# Altium schematic sheet GEM_AFE128_Supply.SchDoc: Supply
size 420 x 297 mm; CheckedBy: K.Belewicz; DrawnBy: G.Kasprowicz; SheetNumber: 5; SheetTotal: 5; ModifiedBy: -; CheckedDate: 12.06.2022; DivGrp: WUT ISE; Designer: G.Kasprowicz
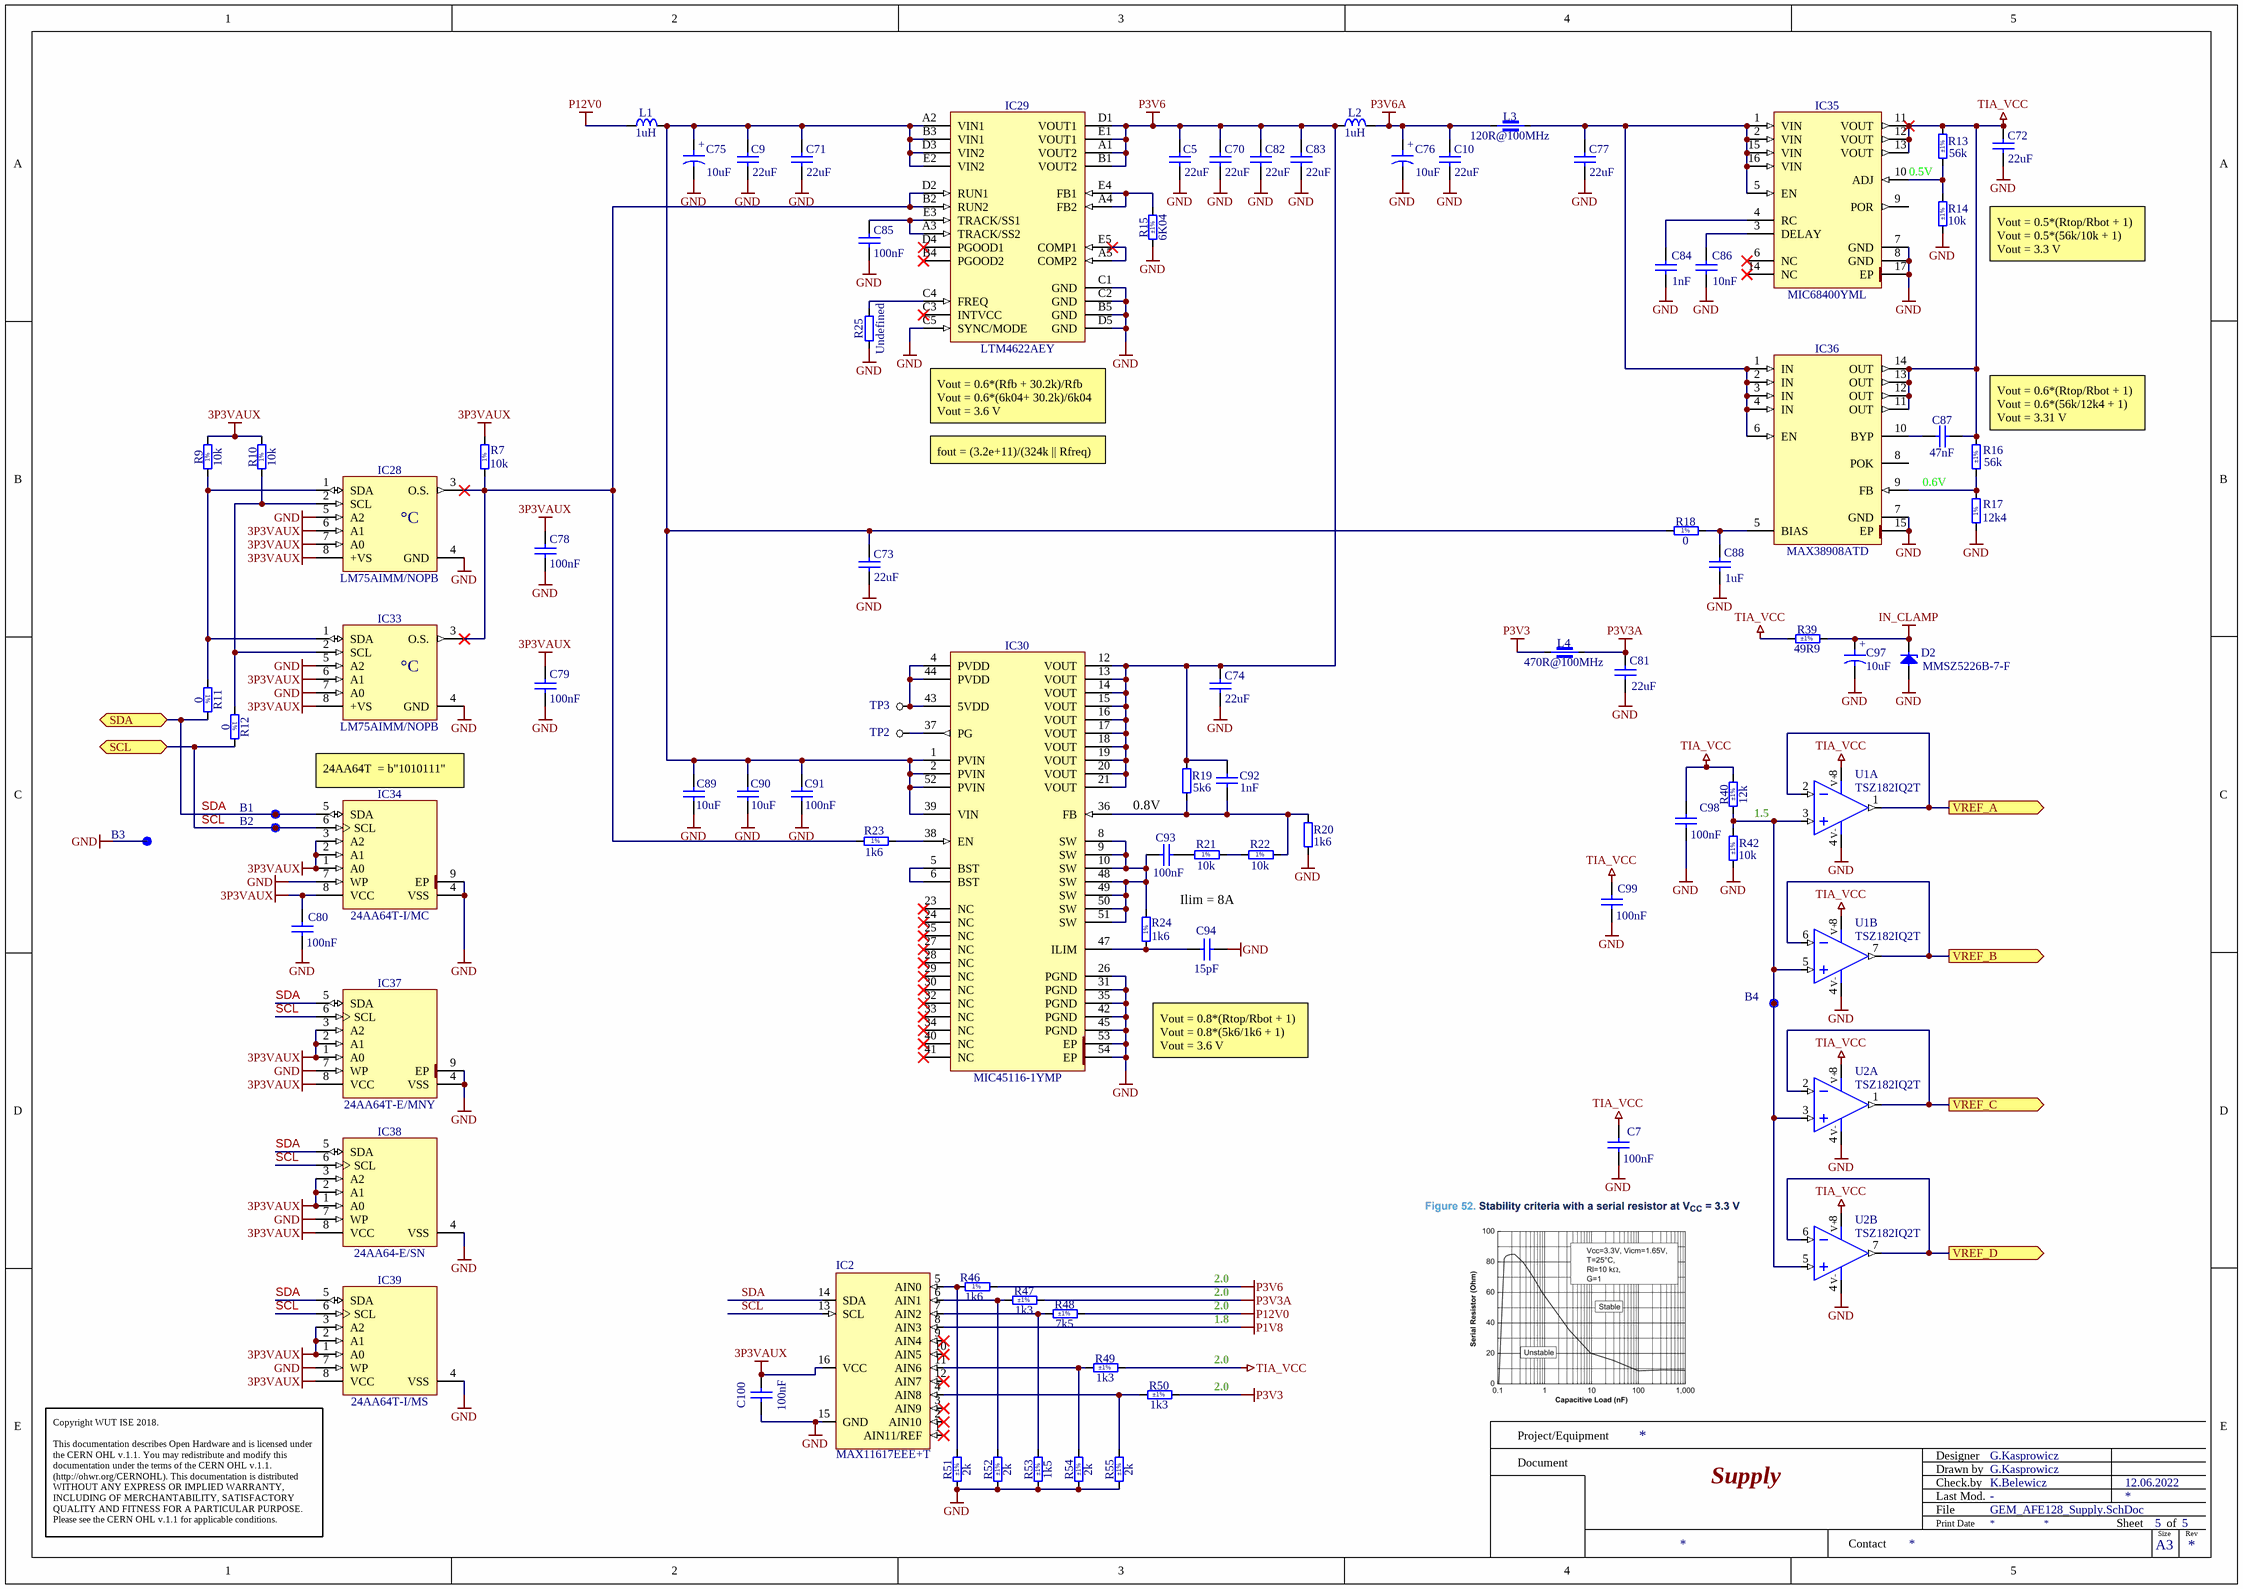
[diagram p0: GEM_AFE128_Supply.SchDoc]

## Parts
B1  SMD Pad  [C100]  (value not drawn)
B2  SMD Pad  [C100]  (value not drawn)
B3  SMD Pad  [C100]  (value not drawn)
B4  SMD Pad  [C100]  (value not drawn)
C5  22uF  [CAPC2012X145N]
C7  100nF  [CAPC0603X33N]
C9  22uF  [CAPC2012X145N]
C10  22uF  [CAPC2012X145N]
C70  22uF  [CAPC2012X145N]
C71  22uF  [CAPC2012X145N]
C72  22uF  [CAPC2012X145N]
C73  22uF  [CAPC2012X145N]
C74  22uF  [CAPC2012X145N]
C75  10uF  [CAPMP3216X180N]
C76  10uF  [CAPMP3216X180N]
C77  22uF  [CAPC2012X145N]
C78  100nF  [CAPC1005X55N]
C79  100nF  [CAPC1005X55N]
C80  100nF  [CAPC1005X55N]
C81  22uF  [CAPC2012X145N]
C82  22uF  [CAPC2012X145N]
C83  22uF  [CAPC2012X145N]
C84  1nF  [CAPC1005X55N]
C85  100nF  [CAPC1005X55N]
C86  10nF  [CAPC1005X55N]
C87  47nF  [CAPC1005X55N]
C88  1uF  [CAPC1005X55N]
C89  10uF  [CAPC2012X135N]
C90  10uF  [CAPC2012X135N]
C91  100nF  [CAPC1005X55N]
C92  1nF  [CAPC1005X55N]
C93  100nF  [CAPC1005X55N]
C94  15pF  [CAPC1005X55N]
C97  10uF  [CAPMP3216X180N]
C98  100nF  [CAPC0603X33N]
C99  100nF  [CAPC0603X33N]
C100  100nF  [CAPC1005X55N]
D2  MMSZ5226B-7-F  [SOD123]
IC2  MAX11617EEE+T  [16 QSOP]
IC28  LM75AIMM/NOPB  [SOP65P490X109-8N]
IC29  LTM4622AEY  [BGA25C127P5X5_625X625X262]
IC30  MIC45116-1YMP  [MICROCHIP_H3QFN88-52LD-PL-3]
IC33  LM75AIMM/NOPB  [SOP65P490X109-8N]
IC34  24AA64T-I/MC  [SON50P300X200X100-9N-R175X155]
IC35  MIC68400YML  [QFN65P400X400X100-17N-S280]
IC36  MAX38908ATD  [SON40P300X300X80-15N-R180X240]
IC37  24AA64T-E/MNY  [TDFN8_2X3MM+EP_N]
IC38  24AA64-E/SN  [SOIC8_N]
IC39  24AA64T-I/MS  [MSOP-8]
L1  1uH  [IND_BOURNS_SRP4020TA]
L2  1uH  [IND_BOURNS_SRP4020TA]
L3  120R@100MHz  [IND_MURATA_BLM31KN]
L4  470R@100MHz  [INDC1608X95N]
R7  10k  [RESC1005X40N]
R9  10k  [RESC1005X40N]
R10  10k  [RESC1005X40N]
R11  0  [RESC1005X40N]
R12  0  [RESC1005X40N]
R13  56k  Tolerance: ±1%  [RESC1005X40N]
R14  10k  Tolerance: ±1%  [RESC1005X40N]
R15  6K04  Tolerance: ±1%  [RESC1005X40N]
R16  56k  Tolerance: ±1%  [RESC1005X40N]
R17  12k4  [RESC1005X40N]
R18  0  [RESC1005X40N]
R19  5k6  [RESC1005X40N]
R20  1k6  [RESC1608X55N]
R21  10k  [RESC1005X40N]
R22  10k  [RESC1005X40N]
R23  1k6  [RESC1005X40N]
R24  1k6  [RESC1005X40N]
R25  Undefined  [RESC1005X40N]
R39  49R9  Tolerance: ±1%  [RESC0603X28N]
R40  12k  Tolerance: ±1%  [RESC1005X40N]
R42  10k  Tolerance: ±1%  [RESC1005X40N]
R46  1k6  [RESC1005X40N]
R47  1k3  Tolerance: ±1%  [RESC1005X40N]
R48  7k5  Tolerance: ±1%  [RESC1005X40N]
R49  1k3  Tolerance: ±1%  [RESC1005X40N]
R50  1k3  Tolerance: ±1%  [RESC1005X40N]
R51  2k  Tolerance: ±1%  [RESC1005X40N]
R52  2k  Tolerance: ±1%  [RESC1005X40N]
R53  1k5  Tolerance: ±1%  [RESC1005X40N]
R54  2k  Tolerance: ±1%  [RESC1005X40N]
R55  2k  Tolerance: ±1%  [RESC1005X40N]
TP2  TP  [TP]  (value not drawn)  (no BOM)
TP3  TP  [TP]  (value not drawn)  (no BOM)
U1  TSZ182IQ2T  [DFN8+EP_N]  (parts A,B of 2)
U2  TSZ182IQ2T  [DFN8+EP_N]  (parts A,B of 2)

## Ports
SCL (bidir), SDA (bidir), VREF_A (out), VREF_B (out), VREF_C (out), VREF_D (out)

## Nets
3P3VAUX: C78.1 C79.1 C80.1 C100.1 IC2.16(VCC) IC28.6(A1) IC28.7(A0) IC28.8(+VS) IC33.6(A1) IC33.8(+VS) IC34.1(A0) IC34.2(A1) IC34.3(A2) IC34.8(VCC) IC37.1(A0) IC37.2(A1) IC37.3(A2) IC37.8(VCC) IC38.1(A0) IC38.2(A1) IC38.3(A2) IC38.8(VCC) IC39.1(A0) IC39.2(A1) IC39.3(A2) IC39.8(VCC) R7.2 R9.2 R10.2
GND: B3.1 C5.1 C7.1 C9.1 C10.1 C70.1 C71.1 C72.1 C73.1 C74.1 C75.2 C76.2 C77.1 C78.2 C79.2 C80.2 C81.1 C82.1 C83.1 C84.1 C85.2 C86.1 C88.1 C89.1 C90.1 C91.1 C94.1 C97.2 C98.1 C99.1 C100.2 D2.2(A) IC2.15(GND) IC28.4(GND) IC28.5(A2) IC29.B5(GND) IC29.C1(GND) IC29.C2(GND) IC29.C5(SYNC/MODE) IC29.D5(GND) IC30.26(PGND) IC30.31(PGND) IC30.35(PGND) IC30.42(PGND) IC30.45(PGND) IC30.53(EP) IC30.54(EP) IC33.4(GND) IC33.5(A2) IC33.7(A0) IC34.4(VSS) IC34.7(WP) IC34.9(EP) IC35.7(GND) IC35.8(GND) IC35.17(EP) IC36.7(GND) IC36.15(EP) IC37.4(VSS) IC37.7(WP) IC37.9(EP) IC38.4(VSS) IC38.7(WP) IC39.4(VSS) IC39.7(WP) R14.1 R15.1 R17.1 R20.1 R25.1 R42.1 R51.1 R52.1 R53.1 R54.1 R55.1 U1.4(V-) U2.4(V-)
IN_CLAMP: C97.1 D2.1(C) R39.2
P1V8: IC2.8(AIN3)
P3V3: L4.1 R50.2
P3V3A: C81.2 L4.2 R47.2
P3V6: C5.2 C70.2 C74.2 C82.2 C83.2 C92.2 IC29.A1(VOUT2) IC29.B1(VOUT2) IC29.D1(VOUT1) IC29.E1(VOUT1) IC30.12(VOUT) IC30.13(VOUT) IC30.14(VOUT) IC30.15(VOUT) IC30.16(VOUT) IC30.17(VOUT) IC30.18(VOUT) IC30.19(VOUT) IC30.20(VOUT) IC30.21(VOUT) L2.1 R19.2 R46.2
P3V6A: C10.2 C76.1 L2.2 L3.1
P12V0: L1.1 R48.2
TIA_VCC: C7.2 C72.2 C87.2 C98.2 C99.2 IC35.11(VOUT) IC35.12(VOUT) IC35.13(VOUT) IC36.11(OUT) IC36.12(OUT) IC36.13(OUT) IC36.14(OUT) R13.2 R16.2 R39.1 R40.2 R49.2 U1.8(V+) U2.8(V+)
SCL: B2.1 IC2.13(SCL) IC34.6(SCL) IC37.6(SCL) IC38.6(SCL) IC39.6(SCL) R12.2 ; port SCL
SDA: B1.1 IC2.14(SDA) IC34.5(SDA) IC37.5(SDA) IC38.5(SDA) IC39.5(SDA) R11.2 ; port SDA
VREF_A: U1.1(OUT) U1.2(IN-) ; port VREF_A
VREF_B: U1.6(IN-) U1.7(OUT) ; port VREF_B
VREF_C: U2.1(OUT) U2.2(IN-) ; port VREF_C
VREF_D: U2.6(IN-) U2.7(OUT) ; port VREF_D
NetB4_1: B4.1 R40.1 R42.2 U1.3(IN+) U1.5(IN+) U2.3(IN+) U2.5(IN+)
NetC9_2: C9.2 C71.2 C73.2 C75.1 C89.2 C90.2 C91.2 IC29.A2(VIN1) IC29.B3(VIN1) IC29.D3(VIN2) IC29.E2(VIN2) IC30.1(PVIN) IC30.2(PVIN) IC30.39(VIN) IC30.52(PVIN) L1.2 R18.1
NetC77_2: C77.2 IC35.1(VIN) IC35.2(VIN) IC35.5(EN) IC35.15(VIN) IC35.16(VIN) IC36.1(IN) IC36.2(IN) IC36.3(IN) IC36.4(IN) IC36.6(EN) L3.2
NetC84_2: C84.2 IC35.4(RC)
NetC85_1: C85.1 IC29.A3(TRACK/SS2) IC29.E3(TRACK/SS1)
NetC86_2: C86.2 IC35.3(DELAY)
NetC87_1: C87.1 IC36.10(BYP)
NetC88_2: C88.2 IC36.5(BIAS) R18.2
NetC92_1: C92.1 IC30.36(FB) R19.1 R20.2 R22.2
NetC93_1: C93.1 R21.1
NetC93_2: C93.2 IC30.8(SW) IC30.9(SW) IC30.10(SW) IC30.48(SW) IC30.49(SW) IC30.50(SW) IC30.51(SW) R24.2
NetC94_2: C94.2 IC30.47(ILIM) R24.1
NetIC2_4: IC2.4(AIN8) R50.1 R55.2
NetIC2_5: IC2.5(AIN0) R46.1 R51.2
NetIC2_6: IC2.6(AIN1) R47.1 R52.2
NetIC2_7: IC2.7(AIN2) R48.1 R53.2
NetIC2_11: IC2.11(AIN6) R49.1 R54.2
NetIC28_1: IC28.1(SDA) IC33.1(SDA) R9.1 R11.1
NetIC28_2: IC28.2(SCL) IC33.2(SCL) R10.1 R12.1
NetIC28_3: IC28.3(O.S.) IC29.B2(RUN2) IC29.D2(RUN1) IC33.3(O.S.) R7.1 R23.1
NetIC29_A4: IC29.A4(FB2) IC29.E4(FB1) R15.2
NetIC29_A5: IC29.A5(COMP2) IC29.E5(COMP1)
NetIC29_C4: IC29.C4(FREQ) R25.2
NetIC30_4: IC30.4(PVDD) IC30.43(5VDD) IC30.44(PVDD) TP3.1
NetIC30_5: IC30.5(BST) IC30.6(BST)
NetIC30_37: IC30.37(PG) TP2.1
NetIC30_38: IC30.38(EN) R23.2
NetIC35_10: IC35.10(ADJ) R13.1 R14.2
NetIC36_9: IC36.9(FB) R16.1 R17.2
NetR21_2: R21.2 R22.1

Not connected (* = marked no-connect by the designer): IC2 1(AIN11/REF)* 2(AIN10)* 3(AIN9)* 9(AIN4)* 10(AIN5)* 12(AIN7)*; IC29 B4(PGOOD2)* C3(INTVCC)* D4(PGOOD1)*; IC30 23(NC)* 24(NC)* 25(NC)* 27(NC)* 28(NC)* 29(NC)* 30(NC)* 32(NC)* 33(NC)* 34(NC)* 40(NC)* 41(NC)*; IC35 6(NC)* 9(POR) 14(NC)*; IC36 8(POK)

## Notes on the sheet
- (near R13) 0.5V
- Vout = 0.5*(Rtop/Rbot + 1)
  Vout = 0.5*(56k/10k + 1)
  Vout = 3.3 V
- (near IC29) Vout = 0.6*(Rfb + 30.2k)/Rfb
  Vout = 0.6*(6k04+ 30.2k)/6k04
  Vout = 3.6 V
- fout = (3.2e+11)/(324k || Rfreq)
- (near R16) Vout = 0.6*(Rtop/Rbot + 1)
  Vout = 0.6*(56k/12k4 + 1)
  Vout = 3.31 V
- 0.6V
- (near IC34) 24AA64T  = b"1010111"
- 0.8V
- 1.5
- Ilim = 8A
- Vout = 0.8*(Rtop/Rbot + 1)
  Vout = 0.8*(5k6/1k6 + 1)
  Vout = 3.6 V
- 2.0
- 1.8
- (near R50) 2.0
- Project/Equipment
- Document
- Designer
- Drawn by
- Check.by
- Copyright WUT ISE 2018.
  This documentation describes Open Hardware and is licensed under the CERN OHL v.1.1. You may redistribute and modify this documentation under the terms of the CERN OHL v.1.1. (http://ohwr.org/CERNOHL). This documentation is distributed WITHOUT ANY EXPRESS OR IMPLIED WARRANTY, INCLUDING OF MERCHANTABILITY, SATISFACTORY QUALITY AND FITNESS FOR A PARTICULAR PURPOSE. Please see the CERN OHL v.1.1 for applicable conditions.
- Contact
- File
- Last Mod.
- Print Date
- Sheet
- Size
- A3
- of
- Rev
- (in symbol CTE3216-18_10UF_16V_20%_AVX_TCJ) +
- (in symbol LM75AIMM/NOPB) °C
- (in symbol R0402_0R_JUMPER) 1%
- (in symbol R0402_1K6_1%_0.0625W_100PPM) 1%
- (in symbol R0402_10K_1%_0.0625W_100PPM) 1%
- (in symbol R0402_12K4_1%_0.0625W_100PPM) 1%

## Library data of the parts
B1-B4 = SMD_PAD_D1MM: Through Hole Pad; Part Description: 1mm Diameter SMD Pad; Mounted: No; Part Number: SMD_PAD_D1MM; Component Kind: Standard (No BOM); Component Type: Standard (No BOM); Pin Count: 1; Family: SMD Pad; Socket: No; SMD: No; Sense: No; Status: None; ComponentHeight: 0mm; HelpURL: Undefined; Author: CERN DEM JLC; CreateDate: 10.10.2017; LatestRevisionDate: 10.10.2017; PackageDescription: 1mm Diameter SMD Pad
C5 C9 C10 C70-C74 C77 C81-C83 = CC0805_22UF_35V_20%_X5R: Non-polarised capacitor; Part Description: SMD Multilayer Chip Ceramic Capacitor; Manufacturer: GENERIC; Manufacturer1 Part Number: C2012X5R1V226M125; Voltage: 35V; TC: X5R; Tolerance: ±20%; Part Number: CC0805_22UF_35V_20%_X5R; Component Kind: Standard; Component Type: Standard; Pin Count: 2; Value: 22uF; Status: Preferred; Manufacturer Part Number: CC0805_22UF_35V_20%_X5R; Case: 0805; Mounted: Yes; Socket: No; SMD: Yes; Sense: No; Manufacturer1 Example: TDK; Manufacturer1 ComponentHeight: 1.45mm; HelpURL: \\cern.ch\dfs\Applications\Altium\Datasheets\CC0805_X5R_TDK_C.pdf; Author: CERN DEM BC; CreateDate: 04.05.2020; LatestRevisionDate: 04.05.2020
C7 C98 C99 = CC0201_100NF_6.3V_10%_X5R: Non-polarised capacitor; Part Description: SMD Multilayer Chip Ceramic Capacitor; Manufacturer: GENERIC; Manufacturer1 Part Number: 02016D104KAT2A; Voltage: 6.3V; TC: X5R; Tolerance: ±10%; Part Number: CC0201_100NF_6.3V_10%_X5R; Component Kind: Standard; Component Type: Standard; Pin Count: 2; Value: 100nF; Status: Not Recommended; Manufacturer Part Number: CC0201_100NF_6.3V_10%_X5R; Case: 0201; Mounted: Yes; Socket: No; SMD: Yes; Sense: No; Manufacturer1 Example: AVX; Manufacturer1 ComponentHeight: 0.33mm; HelpURL: \\cern.ch\dfs\Applications\Altium\Datasheets\CC0201_X5R_AVX.pdf; Author: CERN DEM JLC; CreateDate: 03.12.2007; LatestRevisionDate: 03.12.2007
C75 C76 C97 = CTE3216-18_10UF_16V_20%_AVX_TCJ: Polarised capacitor; Part Description: ESR 0R200 Tantalum Solid Electrolytic Chip Capacitor with Conductive Polymer Electrode; Manufacturer: AVX; Manufacturer Part Number: TCJA106M016R0200; Voltage: 16V; Tolerance: ±20%; Part Number: CTE3216-18_10UF_16V_20%_AVX_TCJ; Component Kind: Standard; Component Type: Standard; Pin Count: 2; Value: 10uF; Status: Preferred; Case: A; Mounted: Yes; Socket: No; SMD: Yes; Sense: No; ComponentHeight: 1.8mm; HelpURL: \\cern.ch\dfs\Applications\Altium\Datasheets\CTE_AVX_TCJ.pdf; Author: CERN DEM JLC; CreateDate: 29.03.2012; LatestRevisionDate: 29.03.2012
C78-C80 C85 C100 = CC0402_100NF_16V_10%_X5R: Non-polarised capacitor; Part Description: SMD Multilayer Chip Ceramic Capacitor; Manufacturer: GENERIC; Manufacturer1 Part Number: GRM155R61C104KA88D; Voltage: 16V; TC: X5R; Tolerance: ±10%; Part Number: CC0402_100NF_16V_10%_X5R; Component Kind: Standard; Component Type: Standard; Pin Count: 2; Value: 100nF; Status: None; Manufacturer Part Number: CC0402_100NF_16V_10%_X5R; Case: 0402; Mounted: Yes; Socket: No; SMD: Yes; Manufacturer1 Example: MURATA; Manufacturer1 ComponentHeight: 0.55mm; HelpURL: \\cern.ch\dfs\Applications\Altium\Datasheets\CC0402_X5R_MURATA_GRM.pdf; Author: CERN DEM JLC; CreateDate: 10.12.2013; LatestRevisionDate: 10.12.2013; Sense: No
C84 = CC0402_1NF_50V_5%_C0G: Non-polarised capacitor; Part Description: SMD Multilayer Chip Ceramic Capacitor; Manufacturer: GENERIC; Manufacturer1 Part Number: C0402C102J5GACTU; Voltage: 50V; TC: C0G/NP0; Tolerance: ±5%; Part Number: CC0402_1NF_50V_5%_C0G; Component Kind: Standard; Component Type: Standard; Pin Count: 2; Value: 1nF; Status: Preferred; Manufacturer Part Number: CC0402_1NF_50V_5%_C0G; Case: 0402; Mounted: Yes; Socket: No; SMD: Yes; Sense: No; Manufacturer1 Example: KEMET; Manufacturer1 ComponentHeight: 0.55mm; HelpURL: \\cern.ch\dfs\Applications\Altium\Datasheets\CC0402_C0G_KEMET_(Commercial Grade).pdf; Author: CERN DEM BC; CreateDate: 02.09.2019; LatestRevisionDate: 02.09.2019
C86 = CC0402_10NF_16V_10%_X7R: Non-polarised capacitor; Part Description: SMD Multilayer Chip Ceramic Capacitor; Manufacturer: GENERIC; Manufacturer1 Part Number: 223878715636; Voltage: 16V; TC: X7R; Tolerance: ±10%; Part Number: CC0402_10NF_16V_10%_X7R; Component Kind: Standard; Component Type: Standard; Pin Count: 2; Value: 10nF; Status: Not Recommended; Manufacturer Part Number: CC0402_10NF_16V_10%_X7R; Case: 0402; Mounted: Yes; Socket: No; SMD: Yes; Sense: No; Manufacturer1 Example: PHYCOMP; Manufacturer1 ComponentHeight: 0.55mm; HelpURL: \\cern.ch\dfs\Applications\Altium\Datasheets\CC0402_X7R_PHYCOMP.pdf; Author: CERN DEM JLC; CreateDate: 03.12.2007; LatestRevisionDate: 03.12.2007
C87 = CC0402_47NF_16V_10%_X7R: Non-polarised capacitor; Part Description: SMD Multilayer Chip Ceramic Capacitor; Manufacturer: GENERIC; Manufacturer1 Part Number: 223878715645; Voltage: 16V; TC: X7R; Tolerance: ±10%; Part Number: CC0402_47NF_16V_10%_X7R; Component Kind: Standard; Component Type: Standard; Pin Count: 2; Value: 47nF; Status: Not Recommended; Manufacturer Part Number: CC0402_47NF_16V_10%_X7R; Case: 0402; Mounted: Yes; Socket: No; SMD: Yes; Sense: No; Manufacturer1 Example: PHYCOMP; Manufacturer1 ComponentHeight: 0.55mm; HelpURL: \\cern.ch\dfs\Applications\Altium\Datasheets\CC0402_X7R_PHYCOMP.pdf; Author: CERN DEM JLC; CreateDate: 03.12.2007; LatestRevisionDate: 03.12.2007
C88 = CC0402_1UF_25V_10%_X5R: Non-polarised capacitor; Part Description: SMD Multilayer Chip Ceramic Capacitor; Manufacturer: GENERIC; Manufacturer1 Part Number: C1005X5R1E105K050; Voltage: 25V; TC: X5R; Tolerance: ±10%; Part Number: CC0402_1UF_25V_10%_X5R; Component Kind: Standard; Component Type: Standard; Pin Count: 2; Value: 1uF; Status: Preferred; Manufacturer Part Number: CC0402_1UF_25V_10%_X5R; Case: 0402; Mounted: Yes; Socket: No; SMD: Yes; Sense: No; Manufacturer1 Example: TDK; Manufacturer1 ComponentHeight: 0.55mm; HelpURL: \\cern.ch\dfs\Applications\Altium\Datasheets\CC0402_X5R_TDK_C.pdf; Author: CERN DEM BC; CreateDate: 17.02.2020; LatestRevisionDate: 17.02.2020
C89 C90 = CC0805_10UF_16V_10%_X5R: Non-polarised capacitor; Part Description: SMD Multilayer Chip Ceramic Capacitor; Manufacturer: GENERIC; Manufacturer1 Part Number: C0805C106K4PAC; Voltage: 16V; TC: X5R; Tolerance: ±10%; Part Number: CC0805_10UF_16V_10%_X5R; Component Kind: Standard; Component Type: Standard; Pin Count: 2; Value: 10uF; Status: Preferred; Manufacturer Part Number: CC0805_10UF_16V_10%_X5R; Case: 0805; Mounted: Yes; Socket: No; SMD: Yes; Manufacturer1 Example: KEMET; Manufacturer1 ComponentHeight: 1.4mm; HelpURL: \\cern.ch\dfs\Applications\Altium\Datasheets\CC1206_X5R_KEMET.pdf; Author: CERN DEM JLC; CreateDate: 03.12.2007; LatestRevisionDate: 03.12.2007; Sense: No
C91 C93 = CC0402_100NF_16V_10%_X5R: Non-polarised capacitor; Part Description: SMD Multilayer Chip Ceramic Capacitor; Manufacturer: GENERIC; Manufacturer1 Part Number: GRM155R61C104KA88D; Voltage: 16V; TC: X5R; Tolerance: ±10%; Table: Capacitors SMD; Part Number: CC0402_100NF_16V_10%_X5R; Component Kind: Standard; Component Type: Standard; Pin Count: 2; Value: 100nF; Status: None; Manufacturer Part Number: CC0402_100NF_16V_10%_X5R; Case: 0402; Mounted: Yes; Socket: No; SMD: Yes; Manufacturer1 Example: MURATA; Manufacturer1 ComponentHeight: 0.55mm; HelpURL: \\cern.ch\dfs\Applications\Altium\Datasheets\CC0402_X5R_MURATA_GRM.pdf; Author: CERN DEM JLC; CreateDate: 2013-12-10; LatestRevisionDate: 2013-12-10
C92 = CC0402_1NF_50V_10%_X7R: Non-polarised capacitor; Part Description: SMD Multilayer Chip Ceramic Capacitor; Manufacturer: GENERIC; Manufacturer1 Part Number: 223858715623; Voltage: 50V; TC: X7R; Tolerance: ±10%; Part Number: CC0402_1NF_50V_10%_X7R; Component Kind: Standard; Component Type: Standard; Pin Count: 2; Value: 1nF; Status: Not Recommended; Manufacturer Part Number: CC0402_1NF_50V_10%_X7R; Case: 0402; Mounted: Yes; Socket: No; SMD: Yes; Sense: No; Manufacturer1 Example: PHYCOMP; Manufacturer1 ComponentHeight: 0.55mm; HelpURL: \\cern.ch\dfs\Applications\Altium\Datasheets\CC0402_X7R_PHYCOMP.pdf; Author: CERN DEM JLC; CreateDate: 03/12/2007; LatestRevisionDate: 03/12/2007
C94 = CC0402_15PF_50V_5%_C0G: Non-polarised capacitor; Part Description: SMD Multilayer Chip Ceramic Capacitor; Manufacturer: GENERIC; Manufacturer1 Part Number: C0402C150J5GACTU; Voltage: 50V; TC: C0G/NP0; Tolerance: ±5%; Part Number: CC0402_15PF_50V_5%_C0G; Component Kind: Standard; Component Type: Standard; Pin Count: 2; Value: 15pF; Status: Preferred; Manufacturer Part Number: CC0402_15PF_50V_5%_C0G; Case: 0402; Mounted: Yes; Socket: No; SMD: Yes; Sense: No; Manufacturer1 Example: KEMET; Manufacturer1 ComponentHeight: 0.55mm; HelpURL: \\cern.ch\dfs\Applications\Altium\Datasheets\CC0805_C0G_KEMET_(Commercial Grade).pdf; Author: CERN DEM JLC; CreateDate: 03.12.2007; LatestRevisionDate: 22.04.2015
D2 = MMSZ5226B-7-F: Zener Diodes 3.3V 500mW; Manufacturer 1 Example: Diodes Incorporated; Manufacturer 1 Component Height: 1.35mm; PressFit: No; DesignItemId: MMSZ5226B-7-F; Author: KB; Device: MMSZ5226B-7-F; Component Kind: Standard; HelpURL: https://www.mouser.pl/datasheet/2/115/DIOD_S_A0003550771_1-2542306.pdf; Manufacturer 1 Part Number: MMSZ5226B-7-F; Mounted: Yes; Part Description: Zener Diodes 3.3V 500mW; Pin Count: 2; Sense: No; SMD: Yes; Socket: No; Supplier 1: Mouser; Create Date: 10.07.2022; LatestRevisionDate: 10.07.2022; Supplier Part Number 1: 621-MMSZ5226B-F
IC2 = MAX11617: 12-, 2-Wire Serial 12-Bit ADCs; Manufacturer: Maxim Integrated; Manufacturer Part Number: MAX11617EEE+T
IC28 IC33 = LM75AIMM/NOPB: Digital Temperature Sensor and Thermal Watchdog with Two-Wire Interface; Part Description: -25° to +100°C ±2°C Digital Temperature Sensor and Thermal Watchdog with Two-Wire Interface; Manufacturer: TEXAS INSTRUMENTS; Table: Sensors; Part Number: LM75AIMM/NOPB; Component Kind: Standard; Component Type: Standard; Device: LM75AIMM/NOPB; PackageDescription: SOP, 0.65mm pitch; 8 pin,3.00mm W X 3.00mm L X 1.09mm H bodyI, PC Medium Density; Manufacturer Part Number: LM75AIMM/NOPB; Pin Count: 8; Case: SSOP8; Mounted: Yes; Socket: No; SMD: Yes; ComponentHeight: 1.09mm; HelpURL: \\cern.ch\dfs\Applications\Altium\Datasheets\LM75AIMM-NOPB.pdf; Author: CERN DEM JLC; CreateDate: 2012-10-15; LatestRevisionDate: 2012-10-15
IC29 = LTM4622AEY#PBF: 3.6V-20V To 1.5V-12V, Dual 2A or Single 4A  Ultrathin Step-Down DC/DC µModule Regulator; Part Description: 3.6V-20V To 1.5V-12V, Dual 2A or Single 4A  Ultrathin Step-Down DC/DC uModule Regulator; Manufacturer: LINEAR TECHNOLOGY; PressFit: No; Bonding: No; Part Number: LTM4622AEY#PBF; Component Kind: Standard; Component Type: Standard; Device: LTM4622AEY; PackageDescription: BGA, 1.27mm Pitch, Square; 25 Pin, 5 Columns X 5 Rows, 6.25mm X 6.25mm X 2.62mm H; Manufacturer Part Number: LTM4622AEY; Pin Count: 25; Case: BGA25; Mounted: Yes; Socket: No; SMD: Yes; Sense: No; ComponentHeight: 2.62mm; HelpURL: \\cern.ch\dfs\Applications\Altium\Datasheets\LTM4622AEY#PBF.pdf; Author: CERN DEM MR; CreateDate: 29.09.2017; LatestRevisionDate: 03.02.2022
IC30 = MIC45116-1YMP: 0.8V to 85% PVIN (4.75-19V), 6A Synchronous Step-Down Regulator Module; Manufacturer: MICROCHIP TECHNOLOGY; PressFit: No; Bonding: No; Part Number: MIC45116-1YMP; Component Kind: Standard; Component Type: Standard; Device: MIC45116-1YMP; PackageDescription: MICROCHIP_H3QFN88-52LD-PL-3, 0.50mm Pitch, Square, 52 Pin, 8mm L X 8mm W X 3mm H Body; Part Description: 0.8V to 85% PVIN (4.75-19V), 6A Synchronous Step-Down Regulator Module; Manufacturer Part Number: MIC45116-1YMP; Pin Count: 53; Mounted: Yes; Socket: No; SMD: Yes; Sense: No; ComponentHeight: 3mm; HelpURL: \\cern.ch\dfs\Applications\Altium\Datasheets\MIC45116-1YMP.pdf; Author: CERN DEM JMW; CreateDate: 15.08.2016; LatestRevisionDate: 15.08.2016
IC34 = 24AA64T-I/MC: 1.7V-5.5V 64K I2C Serial EEPROM; Part Description: 1.7V-5.5V, 64K  (8K x 8-bit) I2C Serial EEPROM; Manufacturer: MICROCHIP TECHNOLOGY; PressFit: No; Bonding: No; Part Number: 24AA64T-I/MC; Component Kind: Standard; Component Type: Standard; Device: 24AA64T-I/MC; PackageDescription: SON (DFN), 0.50mm pitch, 8 pin, 2mm X 3mm X 1.00mm H body (w/thermal tab 1.75 X 1.55mm),  IPC Medium Density; Manufacturer Part Number: 24AA64T-I/MC; Pin Count: 9; Case: DFN8; Mounted: Yes; Socket: No; SMD: Yes; Sense: No; ComponentHeight: 1mm; HelpURL: \\cern.ch\dfs\Applications\Altium\Datasheets\24AA64T-I-MC.pdf; Author: CERN DEM JLC; CreateDate: 18.11.2009; LatestRevisionDate: 24.01.2011
IC35 = MIC68400YML: 4A Sequencing LDO with Tracking and Ramp Control; Part Description: 4A Sequencing Low-Dropout with Tracking and Ramp Control; Manufacturer: MICROCHIP TECHNOLOGY; PressFit: No; Bonding: No; Part Number: MIC68400YML; Component Kind: Standard; Component Type: Standard; Device: MIC68400YML; PackageDescription: QFN, 0.65mm Pitch, Square; 16 Pin, 4.00mm L X 4.00mm W X 1.00mm H body (w/Thermal Tab 2.80 X 2.80mm), IPC Medium Density; Manufacturer Part Number: MIC68400YML; Pin Count: 16; Case: QFN16; Mounted: Yes; Socket: No; SMD: Yes; Sense: No; ComponentHeight: 0.9MM; HelpURL: \\cern.ch\dfs\Applications\Altium\Datasheets\MIC68400YML.pdf; Author: CERN DEM HF; CreateDate: 20.04.2022; LatestRevisionDate: 20.04.2022
IC36 = MAX38908ATD: 4A, High-Performance, Low-Dropout Linear Regulator; Manufacturer: MAXIM; PressFit: No; Bonding: No; Part Number: MAX38908ATD; Component Kind: Standard; Component Type: Standard; Device: MAX38908ATD; PackageDescription: SON, 0.40mm Pitch; 14 Pin, 3.00mm W X 3.00mm L X 0.80mm H Body (w/Thermal Tab1.8mm x 2.4mm); Part Description: 4A, High-Performance, Low-Dropout Linear Regulator; Manufacturer Part Number: MAX38908ATD; Pin Count: 14; Case: SON14; Mounted: Yes; Socket: No; SMD: Yes; Sense: No; ComponentHeight: 0.8mm; HelpURL: \\cern.ch\dfs\Applications\Altium\Datasheets\MAX38908ATD.pdf; Author: CERN DEM HF; CreateDate: 20.04.2022; LatestRevisionDate: 20.04.2022
IC37 = 24AA64T-E/MNY: 1.7V-5.5V 64K I2C Serial EEPROM; Manufacturer: Microchip; Manufacturer 1 Component Height: 0.8mm; PressFit: No; DesignItemId: 24AA64T-E/MNY; Author: KBE; Device: 24AA64T-E/MNY; Component Kind: Standard; Footprint: TDFN-8; HelpURL: https://eu.mouser.com/datasheet/2/268/24AA64_24FC64_24LC64_64_Kbit_I2C_Serial_EEPROM_200-2934388.pdf; Manufacturer Part Number: 24AA64T-E/MNY; Mounted: Yes; Part Description: 1.7V-5.5V 64K I2C Serial EEPROM; Pin Count: 9; Sense: No; SMD: Yes; Socket: No; Supplier 1: Mouser; Create Date: 21.10.2022; LatestRevisionDate: 21.10.2022; Supplier Part Number 1: 579-24AA64T-E/MNY; Part Number: 24AA64T-E/MNY
IC38 = 24AA64-E/SN: 1.7V-5.5V 64K I2C Serial EEPROM; Manufacturer 1 Example: Microchip; Manufacturer 1 Component Height: 1.75mm; PressFit: No; DesignItemId: 24AA64-E/SN; Author: KBE; Device: 24AA64-E/SN; Component Kind: Standard; Footprint: SOIC-8; HelpURL: https://eu.mouser.com/datasheet/2/268/24AA64_24FC64_24LC64_64_Kbit_I2C_Serial_EEPROM_200-2934388.pdf; Manufacturer 1 Part Number: 24AA64-E/SN; Mounted: Yes; Part Description: 1.7V-5.5V 64K I2C Serial EEPROM; Pin Count: 8; Sense: No; SMD: Yes; Socket: No; Supplier 1: Mouser; Create Date: 21.10.2022; LatestRevisionDate: 21.10.2022; Supplier Part Number 1: 579-24AA64-E/SN
IC39 = 24AA64T-I/MS: 1.7V-5.5V 64K I2C Serial EEPROM; Manufacturer 1 Example: Microchip; Manufacturer 1 Component Height: 1.1mm; PressFit: No; DesignItemId: 24AA64T-I/MS; Author: KBE; Device: 24AA64T-I/MS; Component Kind: Standard; HelpURL: https://eu.mouser.com/datasheet/2/268/24AA64_24FC64_24LC64_64_Kbit_I2C_Serial_EEPROM_200-2934388.pdf; Manufacturer 1 Part Number: 24AA64T-I/MS; Mounted: Yes; Part Description: 1.7V-5.5V 64K I2C Serial EEPROM; Pin Count: 8; Sense: No; SMD: Yes; Socket: No; Supplier 1: Mouser; Create Date: 21.10.2022; LatestRevisionDate: 21.10.2022; Supplier Part Number 1: 579-24AA64T-I/MS
L1 L2 = IND_1UH_20%_BOURNS_SRP4020TA: Inductor; Part Description: Shielded Power Inductor; Manufacturer: BOURNS; Manufacturer Part Number: SRP4020TA-1R0M; Power: 5A; Resistance: 0.027R; Tolerance: ±20%; Part Number: IND_1UH_20%_BOURNS_SRP4020TA; Component Kind: Standard; Component Type: Standard; Pin Count: 2; Value: 1uH; Status: None; Mounted: Yes; Socket: No; SMD: Yes; Sense: No; ComponentHeight: 2mm; HelpURL: \\cern.ch\dfs\Applications\Altium\Datasheets\IND_BOURNS_SRP4020TA.pdf; Author: CERN DEM BC; CreateDate: 02.09.2015; LatestRevisionDate: 02.09.2015
L3 = IND1206_MURATA_BLM31KN121SN1: Part Description: SMD Chip Ferrite Bead, BLM31KN_SN Series; Manufacturer: MURATA; Power: 6A; Resistance: 0.009R; Tolerance: ±25%; Part Number: IND1206_MURATA_BLM31KN121SN1; Component Kind: Standard; Component Type: Standard; Footprint: IND_MURATA_BLM31KN1; Pin Count: 2; Value: 120R@100MHz; Manufacturer Part Number: BLM31KN121SN1; Case: 1206; Mounted: Yes; Socket: No; SMD: Yes; Sense: No; ComponentHeight: 1.8mm; HelpURL: \\cern.ch\dfs\Applications\Altium\Datasheets\IND1206_MURATA_ BLM31KN_SN.pdf; Author: CERN DEM HF; CreateDate: 05.01.2022; LatestRevisionDate: 05.01.2022
L4 = IND0603_MURATA_BLM18PG471SN1D: Part Description: SMD EMIFIL Chip Ferrite Bead; Manufacturer: MURATA; Power: 1A; Resistance: 0.2R; Tolerance: ±25%; Part Number: IND0603_MURATA_BLM18PG471SN1D; Component Kind: Standard; Component Type: Standard; Pin Count: 2; Value: 470R@100MHz; Manufacturer Part Number: BLM18PG471SN1D; Case: 0603; Mounted: Yes; Socket: No; SMD: Yes; Sense: No; ComponentHeight: 0.95mm; HelpURL: \\cern.ch\dfs\Applications\Altium\Datasheets\IND0603_MURATA_BLM18P.pdf; Author: CERN DEM BC; CreateDate: 17.02.2021; LatestRevisionDate: 17.02.2021
R7 R9 R10 R21 R22 = R0402_10K_1%_0.0625W_100PPM: Resistor - 1%; Part Description: General Purpose Thick Film Chip Resistor; Manufacturer: GENERIC; Manufacturer1 Part Number: 232270671003L; TC: ±100ppm/°C; Table: Resistors SMD; Part Number: R0402_10K_1%_0.0625W_100PPM; Component Kind: Standard; Component Type: Standard; Pin Count: 2; Value: 10k; Status: Not recommended; Power: 0.0625W; Tolerance: ±1%; Manufacturer Part Number: R0402_10K_1%_0.0625W_100PPM; Case: 0402; Mounted: Yes; Socket: No; SMD: Yes; Manufacturer1 Example: YAGEO PHYCOMP; Manufacturer1 ComponentHeight: 0.4mm; HelpURL: \\cern.ch\dfs\Applications\Altium\Datasheets\R0402_Phycomp_RC0402.pdf; Author: CERN DEM JLC
  R7 R9 R10: CreateDate: 3/12/2007; LatestRevisionDate: 17/10/2012
  R21 R22: CreateDate: 2007-12-03; LatestRevisionDate: 2012-10-17
R11 R12 R18 = R0402_0R_JUMPER: Resistor - 1%; Part Description: 1A (0.05R Max DC Resistance) Zero Ohm Jumper; Manufacturer: GENERIC; Manufacturer1 Part Number: 232270591001; Table: Resistors SMD; Part Number: R0402_0R_JUMPER; Component Kind: Standard; Component Type: Standard; Pin Count: 2; Value: 0; Status: Not recommended; Manufacturer Part Number: R0402_0R_JUMPER; Case: 0402; Mounted: Yes; Socket: No; SMD: Yes; Manufacturer1 Example: PHYCOMP; Manufacturer1 ComponentHeight: 0.4mm; HelpURL: \\cern.ch\dfs\Applications\Altium\Datasheets\R0402_Phycomp_RC0402.pdf; Author: CERN DEM JLC; CreateDate: 2007-12-03; LatestRevisionDate: 2008-03-13
R13 R16 = R0402_56K_1%_0.0625W_100PPM: Resistor - 1%; Part Description: General Purpose Thick Film Chip Resistor; Manufacturer: GENERIC; Manufacturer1 Part Number: 232270675603L; TC: ±100ppm/°C; PressFit: No; Part Number: R0402_56K_1%_0.0625W_100PPM; Component Kind: Standard; Component Type: Standard; Pin Count: 2; Value: 56k; Status: Not Recommended; Power: 0.0625W; Manufacturer Part Number: R0402_56K_1%_0.0625W_100PPM; Case: 0402; Mounted: Yes; Sense: No; Socket: No; SMD: Yes; Manufacturer1 Example: YAGEO PHYCOMP; Manufacturer1 ComponentHeight: 0.4mm; HelpURL: \\cern.ch\dfs\Applications\Altium\Datasheets\R0402_Phycomp_RC0402.pdf; Author: CERN DEM JLC; CreateDate: 03.12.2007; LatestRevisionDate: 17.10.2012
R14 R42 = R0402_10K_1%_0.0625W_100PPM: Resistor - 1%; Part Description: General Purpose Thick Film Chip Resistor; Manufacturer: GENERIC; Manufacturer1 Part Number: 232270671003L; TC: ±100ppm/°C; PressFit: No; Part Number: R0402_10K_1%_0.0625W_100PPM; Component Kind: Standard; Component Type: Standard; Pin Count: 2; Value: 10k; Status: Not Recommended; Power: 0.0625W; Manufacturer Part Number: R0402_10K_1%_0.0625W_100PPM; Case: 0402; Mounted: Yes; Sense: No; Socket: No; SMD: Yes; Manufacturer1 Example: YAGEO PHYCOMP; Manufacturer1 ComponentHeight: 0.4mm; HelpURL: \\cern.ch\dfs\Applications\Altium\Datasheets\R0402_Phycomp_RC0402.pdf; Author: CERN DEM JLC; CreateDate: 03.12.2007; LatestRevisionDate: 17.10.2012
R15 = R0402_6K04_1%_0.063W_100PPM: Resistor - 1%; Part Description: General Purpose Thick Film Chip Resistor; Manufacturer: GENERIC; Manufacturer1 Part Number: CRCW04026K04FK; Power: 0.063W; TC: ±100ppm/°C; PressFit: No; Part Number: R0402_6K04_1%_0.063W_100PPM; Component Kind: Standard; Component Type: Standard; Pin Count: 2; Value: 6K04; Status: None; Manufacturer Part Number: R0402_6K04_1%_0.063W_100PPM; Case: 0402; Mounted: Yes; Sense: No; Socket: No; SMD: Yes; Manufacturer1 Example: VISHAY; Manufacturer1 ComponentHeight: 0.4mm; HelpURL: \\cern.ch\dfs\Applications\Altium\Datasheets\R0402_VISHAY_CRCW e3.pdf; Author: CERN DEM BC; CreateDate: 10.01.2020; LatestRevisionDate: 10.01.2020
R17 = R0402_12K4_1%_0.0625W_100PPM: Resistor - 1%; Part Description: General Purpose Thick Film Chip Resistor; Manufacturer: GENERIC; Manufacturer1 Part Number: CRCW040212K4FKEDC; TC: ±100ppm/°C; PressFit: No; Part Number: R0402_12K4_1%_0.0625W_100PPM; Component Kind: Standard; Component Type: Standard; Pin Count: 2; Value: 12k4; Status: Not Recommended; Power: 0.0625W; Tolerance: ±1%; Manufacturer Part Number: R0402_12K4_1%_0.0625W_100PPM; Case: 0402; Mounted: Yes; Sense: No; Socket: No; SMD: Yes; Manufacturer1 Example: VISHAY BEYSCHLAG; Manufacturer1 ComponentHeight: 0.4mm; HelpURL: \\cern.ch\dfs\Applications\Altium\Datasheets\R0402_Phycomp_RC0402.pdf; Author: CERN DEM JLC; CreateDate: 24.10.2012; LatestRevisionDate: 24.10.2012
R19 = R0402_5k6_1%_0.0625W_100PPM: Resistor - 1%; Part Description: General Purpose Thick Film Chip Resistor; Manufacturer: GENERIC; Manufacturer1 Part Number: 232270675602L; TC: ±100ppm/°C; PressFit: No; Part Number: R0402_5K6_1%_0.0625W_100PPM; Component Kind: Standard; Component Type: Standard; Pin Count: 2; Value: 5k6; Status: Not Recommended; Power: 0.0625W; Tolerance: ±1%; Manufacturer Part Number: R0402_5K6_1%_0.0625W_100PPM; Case: 0402; Mounted: Yes; Sense: No; Socket: No; SMD: Yes; Manufacturer1 Example: YAGEO PHYCOMP; Manufacturer1 ComponentHeight: 0.4mm; HelpURL: \\cern.ch\dfs\Applications\Altium\Datasheets\R0402_Phycomp_RC0402.pdf; Author: CERN DEM JLC; CreateDate: 03.12.2007; LatestRevisionDate: 17.10.2012
R20 = R0603_1K6_1%_0.1W_100PPM: Resistor - 1%; Part Description: General Purpose Thick Film Chip Resistor; Manufacturer: GENERIC; Manufacturer1 Part Number: NRC06F1601TRF; Power: 0.1W; TC: ±100ppm/°C; PressFit: No; Part Number: R0603_1K6_1%_0.1W_100PPM; Component Kind: Standard; Component Type: Standard; Pin Count: 2; Value: 1k6; Status: Preferred; Tolerance: ±1%; Manufacturer Part Number: R0603_1K6_1%_0.1W_100PPM; Case: 0603; Mounted: Yes; Sense: No; Socket: No; SMD: Yes; Manufacturer1 Example: NIC COMPONENT; Manufacturer1 ComponentHeight: 0.55mm; HelpURL: \\cern.ch\dfs\Applications\Altium\Datasheets\R0603_NIC_NRC.pdf; Author: CERN DEM JLC; CreateDate: 03.12.2007; LatestRevisionDate: 13.03.2008
R23 R24 R46 = R0402_1K6_1%_0.0625W_100PPM: Resistor - 1%; Part Description: General Purpose Thick Film Chip Resistor; Manufacturer: GENERIC; Manufacturer1 Part Number: 232270671602L; TC: ±100ppm/°C; PressFit: No; Part Number: R0402_1K6_1%_0.0625W_100PPM; Component Kind: Standard; Component Type: Standard; Pin Count: 2; Value: 1k6; Status: Not Recommended; Power: 0.0625W; Tolerance: ±1%; Manufacturer Part Number: R0402_1K6_1%_0.0625W_100PPM; Case: 0402; Mounted: Yes; Sense: No; Socket: No; SMD: Yes; Manufacturer1 Example: YAGEO PHYCOMP; Manufacturer1 ComponentHeight: 0.4mm; HelpURL: \\cern.ch\dfs\Applications\Altium\Datasheets\R0402_Phycomp_RC0402.pdf; Author: CERN DEM JLC; CreateDate: 03.12.2007; LatestRevisionDate: 17.10.2012
R25 = R0402_NO-VALUE: Resistor; Part Description: Reserved Footprint For a 0402 (1005) Chip Resistor; PressFit: No; Mounted: No; Part Number: R0402_NO-VALUE; Component Kind: Standard; Component Type: Standard; Pin Count: 2; Value: Undefined; Status: None; Manufacturer: Undefined; Manufacturer Part Number: R0402_NO-VALUE; Case: 0402; Sense: No; Socket: No; SMD: Yes; Manufacturer1 Example: Undefined; Manufacturer1 Part Number: Undefined; Manufacturer1 ComponentHeight: Undefined; HelpURL: Undefined; Author: CERN DEM JLC; CreateDate: 03.12.2007; LatestRevisionDate: 13.03.2008
R39 = R0201_49R9_1%_0.05W_200PPM: Resistor - 1%; Part Description: Thick Film Chip Resistor; Manufacturer: GENERIC; Manufacturer1 Part Number: CRCW020149R9FNED; Power: 0.05W; TC: ±200ppm/°C; PressFit: No; Part Number: R0201_49R9_1%_0.05W_200PPM; Component Kind: Standard; Component Type: Standard; Pin Count: 2; Value: 49R9; Status: Not Recommended; Manufacturer Part Number: R0201_49R9_1%_0.05W_200PPM; Case: 0201; Mounted: Yes; Sense: No; Socket: No; SMD: Yes; Manufacturer1 Example: VISHAY; Manufacturer1 ComponentHeight: 0.27mm; HelpURL: \\cern.ch\dfs\Applications\Altium\Datasheets\R0201_VISHAY_CRCW e3.pdf; Author: CERN DEM BC; CreateDate: 10.01.2020; LatestRevisionDate: 10.01.2020
R40 = R0402_12K_1%_0.0625W_100PPM: Resistor - 1%; Part Description: General Purpose Thick Film Chip Resistor; Manufacturer: GENERIC; Manufacturer1 Part Number: 232270671203L; TC: ±100ppm/°C; PressFit: No; Part Number: R0402_12K_1%_0.0625W_100PPM; Component Kind: Standard; Component Type: Standard; Pin Count: 2; Value: 12k; Status: Not Recommended; Power: 0.0625W; Manufacturer Part Number: R0402_12K_1%_0.0625W_100PPM; Case: 0402; Mounted: Yes; Sense: No; Socket: No; SMD: Yes; Manufacturer1 Example: YAGEO PHYCOMP; Manufacturer1 ComponentHeight: 0.4mm; HelpURL: \\cern.ch\dfs\Applications\Altium\Datasheets\R0402_Phycomp_RC0402.pdf; Author: CERN DEM JLC; CreateDate: 03.12.2007; LatestRevisionDate: 17.10.2012
R47 R49 R50 = R0402_1K3_1%_0.0625W_100PPM: Resistor - 1%; Part Description: General Purpose Thick Film Chip Resistor; Manufacturer: GENERIC; Manufacturer1 Part Number: 232270671302L; TC: ±100ppm/°C; PressFit: No; Part Number: R0402_1K3_1%_0.0625W_100PPM; Component Kind: Standard; Component Type: Standard; Pin Count: 2; Value: 1k3; Status: Not Recommended; Power: 0.0625W; Manufacturer Part Number: R0402_1K3_1%_0.0625W_100PPM; Case: 0402; Mounted: Yes; Sense: No; Socket: No; SMD: Yes; Manufacturer1 Example: YAGEO PHYCOMP; Manufacturer1 ComponentHeight: 0.4mm; HelpURL: \\cern.ch\dfs\Applications\Altium\Datasheets\R0402_Phycomp_RC0402.pdf; Author: CERN DEM JLC; CreateDate: 03.12.2007; LatestRevisionDate: 17.10.2012
R48 = R0402_7K5_1%_0.0625W_100PPM: Resistor - 1%; Part Description: General Purpose Thick Film Chip Resistor; Manufacturer: GENERIC; Manufacturer1 Part Number: 232270677502L; TC: ±100ppm/°C; PressFit: No; Part Number: R0402_7K5_1%_0.0625W_100PPM; Component Kind: Standard; Component Type: Standard; Pin Count: 2; Value: 7k5; Status: Not Recommended; Power: 0.0625W; Manufacturer Part Number: R0402_7K5_1%_0.0625W_100PPM; Case: 0402; Mounted: Yes; Sense: No; Socket: No; SMD: Yes; Manufacturer1 Example: YAGEO PHYCOMP; Manufacturer1 ComponentHeight: 0.4mm; HelpURL: \\cern.ch\dfs\Applications\Altium\Datasheets\R0402_Phycomp_RC0402.pdf; Author: CERN DEM JLC; CreateDate: 03.12.2007; LatestRevisionDate: 17.10.2012
R51 R52 R54 R55 = R0402_2K_1%_0.0625W_100PPM: Resistor - 1%; Part Description: General Purpose Thick Film Chip Resistor; Manufacturer: GENERIC; Manufacturer1 Part Number: 232270672002L; TC: ±100ppm/°C; PressFit: No; Part Number: R0402_2K_1%_0.0625W_100PPM; Component Kind: Standard; Component Type: Standard; Pin Count: 2; Value: 2k; Status: Not Recommended; Power: 0.0625W; Manufacturer Part Number: R0402_2K_1%_0.0625W_100PPM; Case: 0402; Mounted: Yes; Sense: No; Socket: No; SMD: Yes; Manufacturer1 Example: YAGEO PHYCOMP; Manufacturer1 ComponentHeight: 0.4mm; HelpURL: \\cern.ch\dfs\Applications\Altium\Datasheets\R0402_Phycomp_RC0402.pdf; Author: CERN DEM JLC; CreateDate: 03.12.2007; LatestRevisionDate: 17.10.2012
R53 = R0402_1K5_1%_0.0625W_100PPM: Resistor - 1%; Part Description: General Purpose Thick Film Chip Resistor; Manufacturer: GENERIC; Manufacturer1 Part Number: 232270671502L; TC: ±100ppm/°C; PressFit: No; Part Number: R0402_1K5_1%_0.0625W_100PPM; Component Kind: Standard; Component Type: Standard; Pin Count: 2; Value: 1k5; Status: Not Recommended; Power: 0.0625W; Manufacturer Part Number: R0402_1K5_1%_0.0625W_100PPM; Case: 0402; Mounted: Yes; Sense: No; Socket: No; SMD: Yes; Manufacturer1 Example: YAGEO PHYCOMP; Manufacturer1 ComponentHeight: 0.4mm; HelpURL: \\cern.ch\dfs\Applications\Altium\Datasheets\R0402_Phycomp_RC0402.pdf; Author: CERN DEM JLC; CreateDate: 03.12.2007; LatestRevisionDate: 17.10.2012
TP2 TP3 = TP: Testpoint
U1 U2 = TSZ182IQ2T: Operational Amplifiers - Op Amps Very high accuracy (25 uV) zero drift 5V CMOS Op-Amps; Manufacturer 1 Example: ST Microelectronics; Manufacturer 1 Component Height: 0.6mm; PressFit: No; DesignItemId: TSZ182IQ2T; Author: KB; Device: TSZ182IQ2T; Component Kind: Standard; Footprint: DFN8 2x2mm; HelpURL: https://www.mouser.pl/datasheet/2/389/tsz181-1852564.pdf; Manufacturer 1 Part Number: TSZ182IQ2T; Mounted: Yes; Part Description: Operational Amplifiers - Op Amps Very high accuracy (25 uV) zero drift 5V CMOS Op-Amps; Pin Count: 8; Sense: No; SMD: Yes; Socket: No; Supplier 1: Mouser; Create Date: 10.07.2022; LatestRevisionDate: 10.07.2022; Supplier Part Number 1: 511-TSZ182IQ2T